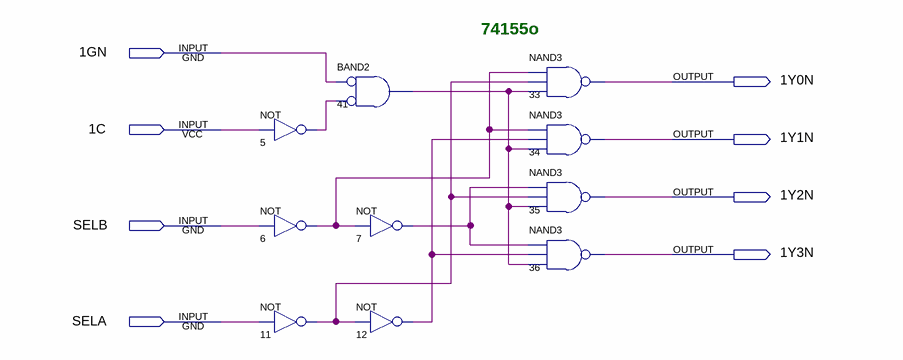
[diagram p0: schematic sheet]
// Quartus schematic Decoder.bdf as structural Verilog: 10 symbols, 8 pins
module Decoder (
  input  \1GN ,
  input  \1C ,
  input  SELB,
  input  SELA,
  output \1Y0N ,
  output \1Y1N ,
  output \1Y2N ,
  output \1Y3N 
);

  wire n5_out, n6_out, n7_out, n11_out, n12_out, n41_out;

  not u_5 (n5_out, \1C );
  not u_6 (n6_out, SELB);
  not u_11 (n11_out, SELA);
  and u_41 (n41_out, ~\1GN , ~n5_out);  // BAND2
  not u_7 (n7_out, n6_out);
  not u_12 (n12_out, n11_out);
  nand u_33 (\1Y0N , n6_out, n11_out, n41_out);
  nand u_34 (\1Y1N , n6_out, n12_out, n41_out);
  nand u_35 (\1Y2N , n7_out, n11_out, n41_out);
  nand u_36 (\1Y3N , n7_out, n12_out, n41_out);

  // Notes on the sheet:
  //   74155o
endmodule
